# Altium schematic sheet mcu.SchDoc
size A4
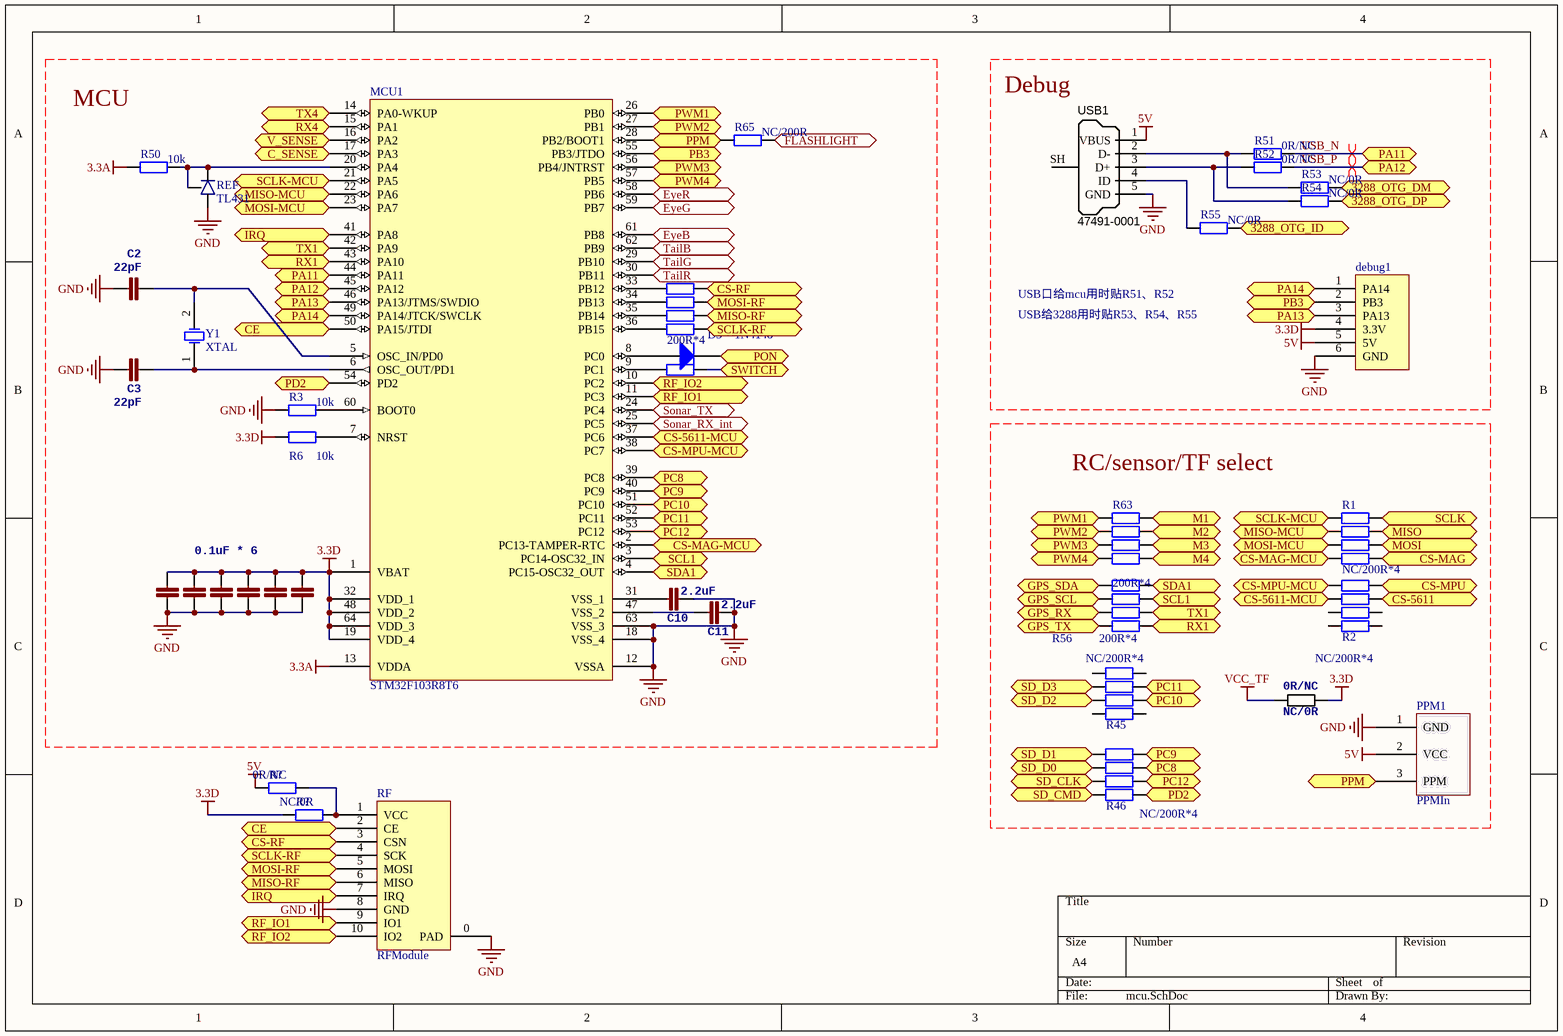
[diagram p0: mcu.SchDoc]

## Parts
(Parts that share a designator on the sheet are numbered #1, #2 ... from top to bottom, then left to right.)
0R/NC  NC/0R  [0402]
C2  22pF  [0402]
C3  22pF  [0402]
C4  0.1uF * 6  [0402]
C5  1n  [0402]  (value not drawn)
C6  1n  [0402]  (value not drawn)
C7  1n  [0402]  (value not drawn)
C8  1n  [0402]  (value not drawn)
C9  1n  [0402]  (value not drawn)
C10  2.2uF  [0603]
C11  2.2uF  [0603]
D3  1N4148  [LC-SOD-323]
debug1  debug  [WFRSM125]  (value not drawn)
MCU1  STM32F103R8T6  [LQFP64_N]
PPM1  PPMIn  [ServoConnector]
R1  NC/200R*4  [0402X4]
R2  NC/200R*4  [0402X4]
R3  10k  [0402]
R6  10k  [0402]
R8  200R*4  [0402X4]
R44  1k  [0402]
R45  NC/200R*4  [0402X4]
R46  NC/200R*4  [0402X4]
R50  10k  [0402]
R51  0R/NC  [0402]
R52  0R/NC  [0402]
R53  NC/0R  [0402]
R54  NC/0R  [0402]
R55  NC/0R  [0402]
R56  200R*4  [0402X4]
R63  200R*4  [0402X4]
R65  NC/200R  [0402]
R?#1  value 0R/NC  [0402]
R?#2  value NC/0R  [0402]
REF  TL431  [SOT-23B_L]
RF  RFModule  [RFModule]
USB1  Manufacturer Part Number 1: 47491-0001  [MOLEX-47346-0001]  (hidden comment: USB Micro Type B)
Y1  XTAL  [5032]

## Ports
3288_OTG_DM, 3288_OTG_DP, 3288_OTG_ID, C_SENSE, CE, CS-5611, CS-5611-MCU, CS-MAG (bidir), CS-MAG-MCU (bidir), CS-MPU, CS-MPU-MCU, CS-RF, EyeB, EyeG, EyeR, FLASHLIGHT, GPS_RX, GPS_SCL, GPS_SDA, GPS_TX, IRQ, M1, M2, M3, M4, MISO, MISO-MCU, MISO-RF, MOSI, MOSI-MCU, MOSI-RF, PA11, PA12, PA13, PA14, PB3, PC8, PC9, PC10, PC11, PC12, PD2, PON, PPM, PWM1, PWM2, PWM3, PWM4, RF_IO1, RF_IO2, RX1, RX4, SCL1, SCLK, SCLK-MCU, SCLK-RF, SD_CLK, SD_CMD, SD_D0, SD_D1, SD_D2, SD_D3, SDA1, Sonar_RX_int, Sonar_TX, SWITCH, TailB, TailG, TailR, TX1, TX4, V_SENSE

## Nets
3.3A: MCU1.13(VDDA) R50.1
3.3D: 0R/NC.2 C4.2 C5.2 C6.2 C7.2 C8.2 C9.2 debug1.4(3.3V) MCU1.1(VBAT) MCU1.19(VDD_4) MCU1.32(VDD_1) MCU1.48(VDD_2) MCU1.64(VDD_3) R6.2 R?#2.1
5V: debug1.5(5V) PPM1.2(VCC) R?#1.1 USB1.1(VBUS)
GND: C2.2 C3.2 C4.1 C5.1 C6.1 C7.1 C8.1 C9.1 C10.2 C11.2 debug1.6(GND) MCU1.12(VSSA) MCU1.18(VSS_4) MCU1.63(VSS_3) PPM1.1(GND) R3.1 REF.3(ANODE) RF.0(PAD) RF.8(GND) USB1.5(GND)
VCC_TF: 0R/NC.1
3288_OTG_DM: R53.2 ; port 3288_OTG_DM
3288_OTG_DP: R54.2 ; port 3288_OTG_DP
3288_OTG_ID: R55.2 ; port 3288_OTG_ID
C_SENSE: MCU1.17(PA3) ; port C_SENSE
CE: MCU1.50(PA15/JTDI) RF.2(CE) ; port CE
CS-5611: R2.7 ; port CS-5611
CS-5611-MCU: MCU1.37(PC6) R2.2 ; port CS-5611-MCU
CS-MAG: R1.4 ; port CS-MAG
CS-MAG-MCU: MCU1.2(PC13-TAMPER-RTC) R1.5 ; port CS-MAG-MCU
CS-MPU: R2.8 ; port CS-MPU
CS-MPU-MCU: MCU1.38(PC7) R2.1 ; port CS-MPU-MCU
CS-RF: R8.5 RF.3(CSN) ; port CS-RF
EyeB: MCU1.61(PB8) ; port EyeB
EyeG: MCU1.59(PB7) ; port EyeG
EyeR: MCU1.58(PB6) ; port EyeR
FLASHLIGHT: R65.2 ; port FLASHLIGHT
GPS_RX: R56.7 ; port GPS_RX
GPS_SCL: R56.6 ; port GPS_SCL
GPS_SDA: R56.5 ; port GPS_SDA
GPS_TX: R56.8 ; port GPS_TX
IRQ: MCU1.41(PA8) RF.7(IRQ) ; port IRQ
M1: R63.1 ; port M1
M2: R63.2 ; port M2
M3: R63.3 ; port M3
M4: R63.4 ; port M4
MISO: R1.2 ; port MISO
MISO-MCU: MCU1.22(PA6) R1.7 ; port MISO-MCU
MISO-RF: R8.7 RF.6(MISO) ; port MISO-RF
MOSI: R1.3 ; port MOSI
MOSI-MCU: MCU1.23(PA7) R1.6 ; port MOSI-MCU
MOSI-RF: R8.6 RF.5(MOSI) ; port MOSI-RF
PA13: debug1.3(PA13) MCU1.46(PA13/JTMS/SWDIO) ; port PA13
PA14: debug1.1(PA14) MCU1.49(PA14/JTCK/SWCLK) ; port PA14
PB3: debug1.2(PB3) MCU1.55(PB3/JTDO) ; port PB3
PC8: MCU1.39(PC8) R46.7 ; port PC8
PC9: MCU1.40(PC9) R46.8 ; port PC9
PC10: MCU1.51(PC10) R45.6 ; port PC10
PC11: MCU1.52(PC11) R45.7 ; port PC11
PC12: MCU1.53(PC12) R46.6 ; port PC12
PD2: MCU1.54(PD2) R46.5 ; port PD2
PON: D3.2(K) ; port PON
PPM: MCU1.28(PB2/BOOT1) PPM1.3(PPM) R65.1 ; port PPM
PWM1: MCU1.26(PB0) R63.8 ; port PWM1
PWM2: MCU1.27(PB1) R63.7 ; port PWM2
PWM3: MCU1.56(PB4/JNTRST) R63.6 ; port PWM3
PWM4: MCU1.57(PB5) R63.5 ; port PWM4
RF_IO1: MCU1.11(PC3) RF.9(IO1) ; port RF_IO1
RF_IO2: MCU1.10(PC2) RF.10(IO2) ; port RF_IO2
RX1: MCU1.43(PA10) R56.1 ; port RX1
RX4: MCU1.15(PA1) ; port RX4
SCL1: MCU1.3(PC14-OSC32_IN) R56.3 ; port SCL1
SCLK: R1.1 ; port SCLK
SCLK-MCU: MCU1.21(PA5) R1.8 ; port SCLK-MCU
SCLK-RF: R8.8 RF.4(SCK) ; port SCLK-RF
SD_CLK: R46.3 ; port SD_CLK
SD_CMD: R46.4 ; port SD_CMD
SD_D0: R46.2 ; port SD_D0
SD_D1: R46.1 ; port SD_D1
SD_D2: R45.3 ; port SD_D2
SD_D3: R45.2 ; port SD_D3
SDA1: MCU1.4(PC15-OSC32_OUT) R56.4 ; port SDA1
Sonar_RX_int: MCU1.25(PC5) ; port Sonar_RX_int
Sonar_TX: MCU1.24(PC4) ; port Sonar_TX
SWITCH: R44.1 ; port SWITCH
TailB: MCU1.62(PB9) ; port TailB
TailG: MCU1.29(PB10) ; port TailG
TailR: MCU1.30(PB11) ; port TailR
TX1: MCU1.42(PA9) R56.2 ; port TX1
TX4: MCU1.14(PA0-WKUP) ; port TX4
USB_N: MCU1.44(PA11) R51.2 ; port PA11
USB_P: MCU1.45(PA12) R52.2 ; port PA12
V_SENSE: MCU1.16(PA2) ; port V_SENSE
NetC2_1: C2.1 MCU1.5(OSC_IN/PD0) Y1.2(OSC2)
NetC3_1: C3.1 MCU1.6(OSC_OUT/PD1) Y1.1(OSC1)
NetC10_1: C10.1 MCU1.31(VSS_1)
NetC11_1: C11.1 MCU1.47(VSS_2)
NetD3_1: D3.1(A) MCU1.8(PC0)
NetMCU1_7: MCU1.7(NRST) R6.1
NetMCU1_9: MCU1.9(PC1) R44.2
NetMCU1_20: MCU1.20(PA4) R50.2 REF.1(REF) REF.2(CATHODE)
NetMCU1_33: MCU1.33(PB12) R8.4
NetMCU1_34: MCU1.34(PB13) R8.3
NetMCU1_35: MCU1.35(PB14) R8.2
NetMCU1_36: MCU1.36(PB15) R8.1
NetMCU1_60: MCU1.60(BOOT0) R3.2
NetR51_1: R51.1 R53.1 USB1.2(D-)
NetR52_1: R52.1 R54.1 USB1.3(D+)
NetR55_1: R55.1 USB1.4(ID)
NetR?#1_2: R?#1.2 R?#2.2 RF.1(VCC)

Not connected (* = marked no-connect by the designer): R2 3 4 5 6; R45 1 4 5 8; USB1 SH(Shell)

## Layout directives
differential pair: USB_N, USB_P

## Notes on the sheet
- MCU
- (near USB1) Debug
- USB口给mcu用时贴R51、R52
- USB给3288用时贴R53、R54、R55
- RC/sensor/TF select

## Library data of the parts
0R/NC = RESISTOR0603B: <b>Resistor</b> / Basic schematic elements and footprints for 0603, 1206, and PTH 1/10th watt (small) resistors.; PARTNO: RMCF0402FT453K
C2-C11 = CAP0402-CAP: <b>Capacitor</b> / Standard 0603 ceramic capacitor, and 0.1" leaded capacitor.; PARTNO: CC0402ZRY5V7BB104
D3 = Diode 1N4148: High Conductance Fast Diode; Published: 8-Jun-2000; LatestRevisionDate: 17-Jul-2002; LatestRevisionNote: Re-released for DXP Platform.; DatasheetVersion: 1997; PackageReference: DO-35; Publisher: Altium Limited; PackageDescription: Diode, Axial; Body 3.8 x 1.9 mm (LxDia. max), Lead Dia. 0.53 mm (max); Code_JEDEC: DO-204-AH; ComponentLink1Description: Manufacturer Link; ComponentLink1URL: http://www.fairchildsemi.com/; ComponentLink2Description: Datasheet; ComponentLink2URL: http://www.fairchildsemi.com/ds/1N%2F1N4148.pdf
MCU1 = STM32F103R8T6: STM32 ARM-based 32-bit MCU with 64 Kbytes Flash, 64-pin LQFP, Industrial Temperature; Published: *; DatasheetVersion: *; PackageVersion: *; PackageReference: *; Publisher: *; PackageDescription: *; ComponentLink1Description: *; ComponentLink1URL: *; ComponentLink2Description: *; ComponentLink2URL: *
R1 R2 R8 R45 R46 R56 R63 = Res*4: Resistor; Published: 8-Jun-2000; LatestRevisionDate: 17-Jul-2002; LatestRevisionNote: Re-released for DXP Platform.; PackageReference: AXIAL-0.4; Publisher: Altium Limited; PackageDescription: Axial Device, Thru-Hole; 2 Leads; 0.4 in Pin Spacing
R3 R6 R44 R50-R55 R65 = Res2: Resistor; Value: 0Ohm; Published: 8-Jun-2000; LatestRevisionDate: 17-Jul-2002; LatestRevisionNote: Re-released for DXP Platform.; PackageReference: AXIAL-0.4; Publisher: Altium Limited; PackageDescription: Axial Device, Thru-Hole; 2 Leads; 0.4 in Pin Spacing
R?#1 R?#2 = Res2: Resistor; Published: 8-Jun-2000; LatestRevisionDate: 17-Jul-2002; LatestRevisionNote: Re-released for DXP Platform.; PackageReference: AXIAL-0.4; Publisher: Altium Limited; PackageDescription: Axial Device, Thru-Hole; 2 Leads; 0.4 in Pin Spacing
USB1 = USB_Micro_TypeB: Connector SMD USB Micro Type B middle mount; Manufacturer 1: Molex Inc; SCDType: undef; Package / Case: SMD; Supplier 1: Digi-Key; Supplier Part Number 1: WM17142CT-ND
Y1 = XTAL: Crystal Oscillator; Published: 8-Jun-2000; LatestRevisionDate: 17-Jul-2002; LatestRevisionNote: Re-released for DXP Platform.; PackageReference: R38; Publisher: Altium Limited; PackageDescription: Crystal, Thru-Hole; 2 Leads; Body 3.1 x 8.2 mm (Dia.xH)